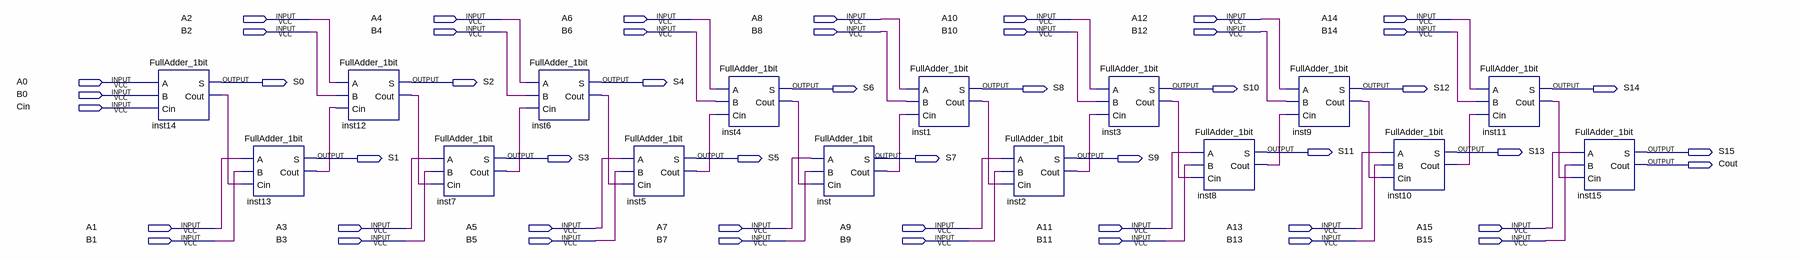
[diagram p0: schematic sheet]
// Quartus schematic FullAdder_16bit.bdf as structural Verilog: 16 symbols, 50 pins
module FullAdder_16bit (
  input  A2,
  input  A4,
  input  A6,
  input  A8,
  input  A10,
  input  A12,
  input  A14,
  input  B2,
  input  B4,
  input  B6,
  input  B8,
  input  B10,
  input  B12,
  input  B14,
  input  A0,
  input  B0,
  input  Cin,
  input  A1,
  input  A3,
  input  A5,
  input  A7,
  input  A9,
  input  A11,
  input  A13,
  input  A15,
  input  B1,
  input  B3,
  input  B5,
  input  B7,
  input  B9,
  input  B11,
  input  B13,
  input  B15,
  output S0,
  output S2,
  output S4,
  output S6,
  output S8,
  output S10,
  output S12,
  output S14,
  output S11,
  output S13,
  output S15,
  output S1,
  output S3,
  output S5,
  output S7,
  output S9,
  output Cout
);

  wire inst1_cout, inst2_cout, inst3_cout, inst4_cout, inst5_cout, inst6_cout, inst7_cout, inst8_cout,
       inst9_cout, inst10_cout, inst11_cout, inst12_cout, inst13_cout, inst14_cout, inst_cout;

  FullAdder_1bit inst14 (.A(A0), .B(B0), .Cin(Cin), .S(S0), .Cout(inst14_cout));
  FullAdder_1bit inst13 (.A(A1), .B(B1), .Cin(inst14_cout), .S(S1), .Cout(inst13_cout));
  FullAdder_1bit inst12 (.A(A2), .B(B2), .Cin(inst13_cout), .S(S2), .Cout(inst12_cout));
  FullAdder_1bit inst7 (.A(A3), .B(B3), .Cin(inst12_cout), .S(S3), .Cout(inst7_cout));
  FullAdder_1bit inst6 (.A(A4), .B(B4), .Cin(inst7_cout), .S(S4), .Cout(inst6_cout));
  FullAdder_1bit inst5 (.A(A5), .B(B5), .Cin(inst6_cout), .S(S5), .Cout(inst5_cout));
  FullAdder_1bit inst4 (.A(A6), .B(B6), .Cin(inst5_cout), .S(S6), .Cout(inst4_cout));
  FullAdder_1bit inst (.A(A7), .B(B7), .Cin(inst4_cout), .Cout(inst_cout));  // open: S
  FullAdder_1bit inst1 (.A(A8), .B(B8), .Cin(inst_cout), .S(S8), .Cout(inst1_cout));
  FullAdder_1bit inst2 (.A(A9), .B(B9), .Cin(inst1_cout), .S(S9), .Cout(inst2_cout));
  FullAdder_1bit inst3 (.A(A10), .B(B10), .Cin(inst2_cout), .S(S10), .Cout(inst3_cout));
  FullAdder_1bit inst8 (.A(A11), .B(B11), .Cin(inst3_cout), .S(S11), .Cout(inst8_cout));
  FullAdder_1bit inst9 (.A(A12), .B(B12), .Cin(inst8_cout), .S(S12), .Cout(inst9_cout));
  FullAdder_1bit inst10 (.A(A13), .B(B13), .Cin(inst9_cout), .S(S13), .Cout(inst10_cout));
  FullAdder_1bit inst11 (.A(A14), .B(B14), .Cin(inst10_cout), .S(S14), .Cout(inst11_cout));
  FullAdder_1bit inst15 (.A(A15), .B(B15), .Cin(inst11_cout), .S(S15), .Cout(Cout));
endmodule
